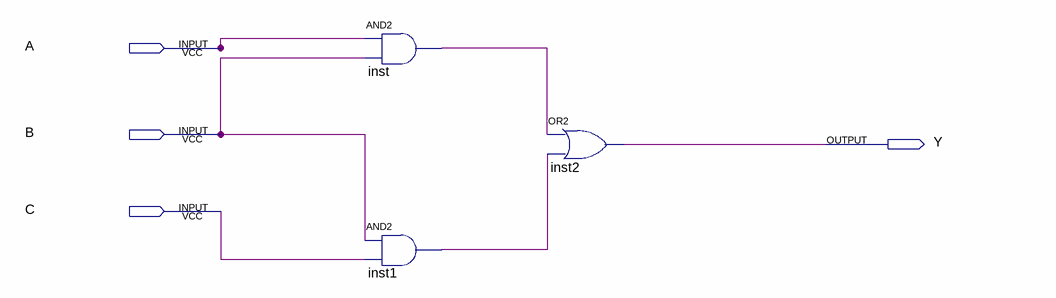
[diagram p0: schematic sheet]
// Quartus schematic Demo1.bdf as structural Verilog: 3 symbols, 4 pins
module Demo1 (
  input  A,
  input  B,
  input  C,
  output Y
);

  wire inst1_out, inst_out;

  and inst (inst_out, A, B);
  and inst1 (inst1_out, B, C);
  or inst2 (Y, inst_out, inst1_out);
endmodule
